# EAGLE schematic motor_driver (EAGLE 7.1.0)
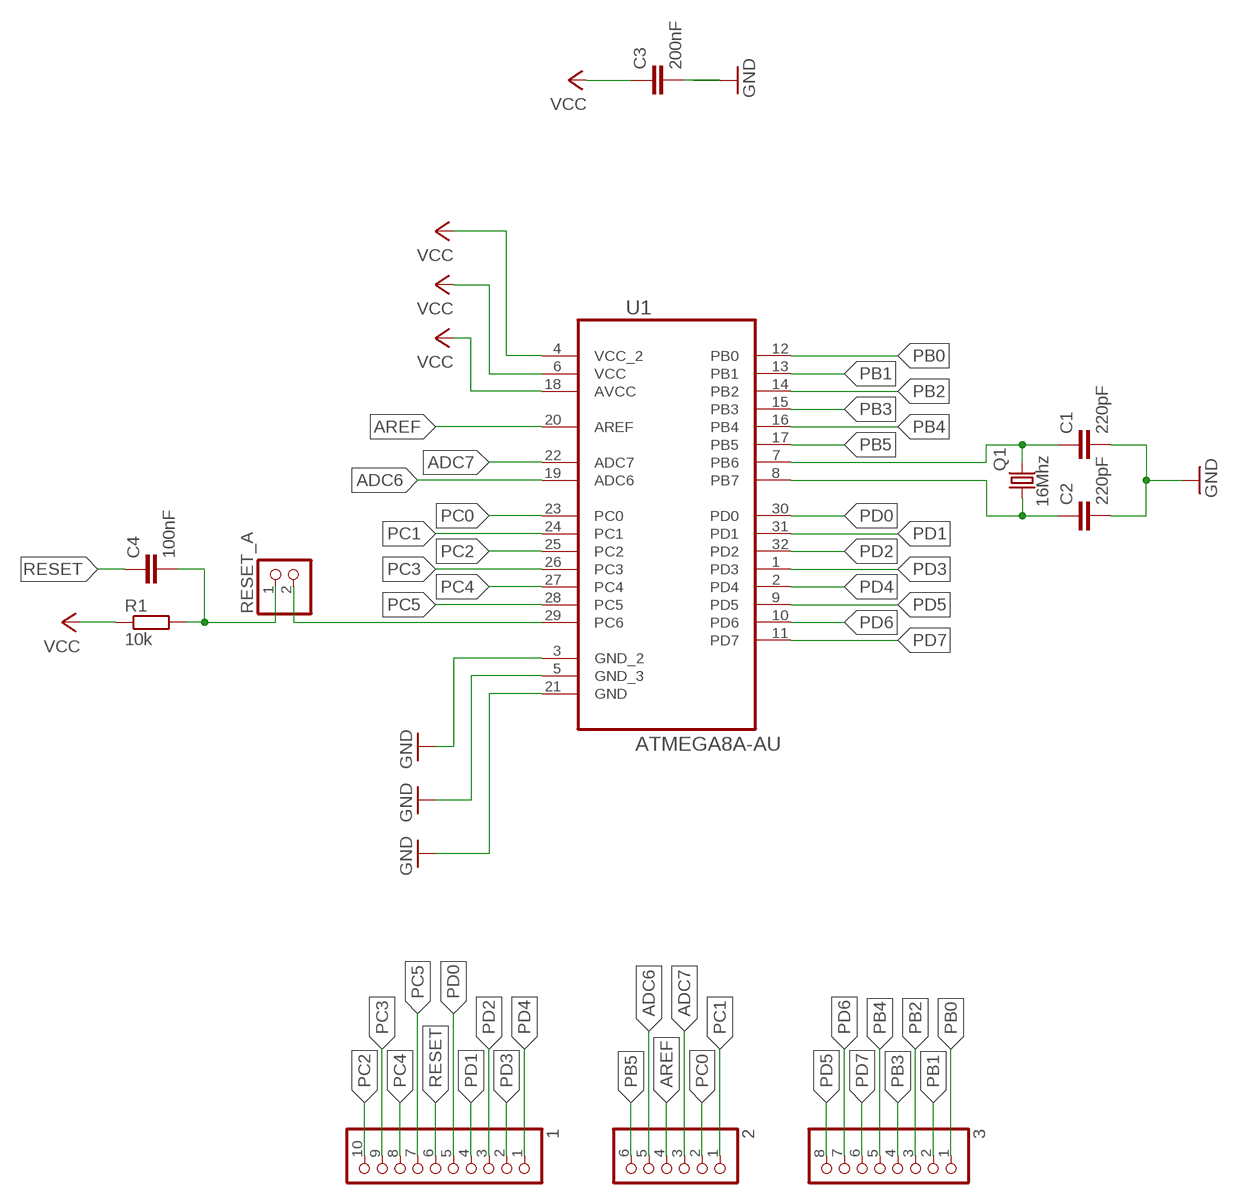
[diagram p0: schematic, sheet 1]

## Parts
1  PINHD-1X10  [1X10]
2  PINHD-1X6  [1X06]
3  PINHD-1X8  [1X08]
C1  220pF  C2,5-3  [C2.5-3]
C2  220pF  C2,5-3  [C2.5-3]
C3  200nF  C2,5-3  [C2.5-3]
C4  100nF  C2,5-3  [C2.5-3]
Q1  16Mhz  CRYSTALHC49U-V  [HC49U-V]
R1  10k  R  [R0805]
RESET_A  PINHD-1X2  [1X02]
U1  ATMEGA8A-AU  [QFP80P900X900X120-32N]

## Nets
^RESET: C4.2 R1.2 RESET_A.1
ADC6: 2.5 U1.19(ADC6)
ADC7: 2.3 U1.22(ADC7)
AREF: 2.4 U1.20(AREF)
GND: C1.2 C2.2 C3.2 U1.3(GND_2) U1.5(GND_3) U1.21(GND)
N$1: C1.1 Q1.2 U1.7(PB6)
N$2: C2.1 Q1.1 U1.8(PB7)
N$3: RESET_A.2 U1.29(PC6)
PB0: 3.1 U1.12(PB0)
PB1: 3.2 U1.13(PB1)
PB2: 3.3 U1.14(PB2)
PB3: 3.4 U1.15(PB3)
PB4: 3.5 U1.16(PB4)
PB5: 2.6 U1.17(PB5)
PC0: 2.2 U1.23(PC0)
PC1: 2.1 U1.24(PC1)
PC2: 1.10 U1.25(PC2)
PC3: 1.9 U1.26(PC3)
PC4: 1.8 U1.27(PC4)
PC5: 1.7 U1.28(PC5)
PD0: 1.5 U1.30(PD0)
PD1: 1.4 U1.31(PD1)
PD2: 1.3 U1.32(PD2)
PD3: 1.2 U1.1(PD3)
PD4: 1.1 U1.2(PD4)
PD5: 3.8 U1.9(PD5)
PD6: 3.7 U1.10(PD6)
PD7: 3.6 U1.11(PD7)
RESET: 1.6 C4.1
VCC: C3.1 R1.1 U1.4(VCC_2) U1.6(VCC) U1.18(AVCC)

## Library data of the parts
1 = pinhead:PINHD-1X10: PIN HEADER
2 = pinhead:PINHD-1X6: PIN HEADER
3 = pinhead:PINHD-1X8: PIN HEADER
C1-C4 = capacitor-wima:C: CAPACITOR naming: grid - package width
Q1 = crystal:CRYSTAL: CRYSTAL; OC_FARNELL: 1666969; OC_NEWARK: unknown
R1 = eagle-ltspice:R: RESISTOR, European symbol; SPICEMODEL: NONE; SPICEPREFIX: R
RESET_A = pinhead:PINHD-1X2: PIN HEADER
U1 = Atmel_By_element14_Batch_1-00:ATMEGA8A-AU: Programmable Flash; MPN: ATMEGA8A-AU; OC_FARNELL: 1748532; OC_NEWARK: 26R5638; PACKAGE: TQFP-32; SUPPLIER: Atmel